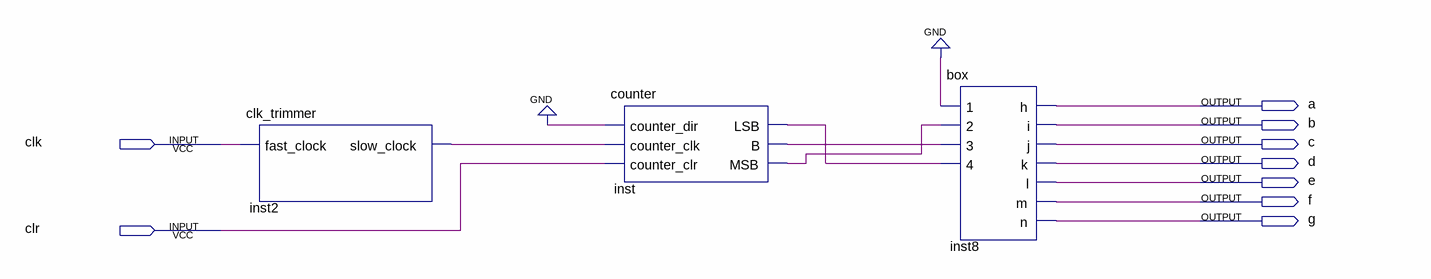
[diagram p0: schematic sheet]
// Quartus schematic bcd.bdf as structural Verilog: 3 symbols, 9 pins
module bcd (
  input  clk,
  input  clr,
  output a,
  output b,
  output c,
  output d,
  output e,
  output f,
  output g
);

  wire inst2_slow_clock, inst_b, inst_lsb, inst_msb;

  clk_trimmer inst2 (.fast_clock(clk), .slow_clock(inst2_slow_clock));
  counter inst (
    .counter_dir(1'b0), .counter_clk(inst2_slow_clock), .counter_clr(clr), .LSB(inst_lsb), .B(inst_b),
    .MSB(inst_msb));
  box inst8 (.\1 (1'b0), .\2 (inst_msb), .\3 (inst_b), .\4 (inst_lsb), .h(a), .i(b), .j(c), .k(d), .l(e), .m(f), .n(g));
endmodule
